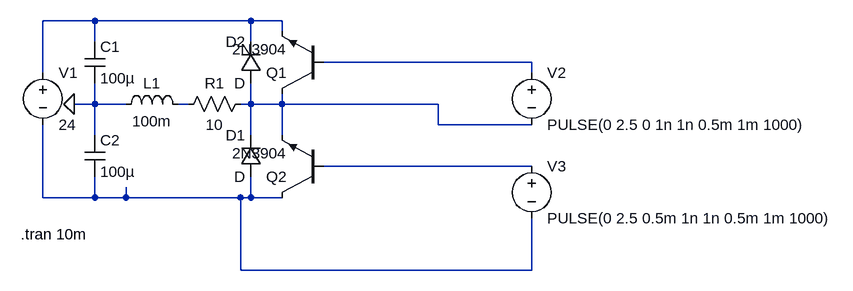
[diagram p0: schematic Halfbridge.asc]
Halfbridge.asc, the LTspice schematic file:
Version 4
SHEET 1 1244 680
WIRE 80 0 0 0
WIRE 320 0 80 0
WIRE 368 0 320 0
WIRE 368 16 368 0
WIRE 80 32 80 0
WIRE 320 32 320 0
WIRE 752 64 432 64
WIRE 0 80 0 0
WIRE 752 80 752 64
WIRE 80 128 80 96
WIRE 80 128 48 128
WIRE 128 128 80 128
WIRE 224 128 208 128
WIRE 320 128 320 96
WIRE 320 128 304 128
WIRE 368 128 368 112
WIRE 368 128 320 128
WIRE 608 128 368 128
WIRE 608 160 608 128
WIRE 752 160 608 160
WIRE 80 176 80 128
WIRE 320 176 320 128
WIRE 368 176 368 128
WIRE 752 224 432 224
WIRE 0 272 0 160
WIRE 80 272 80 240
WIRE 80 272 0 272
WIRE 128 272 128 256
WIRE 128 272 80 272
WIRE 304 272 128 272
WIRE 320 272 320 240
WIRE 320 272 304 272
WIRE 368 272 320 272
WIRE 304 384 304 272
WIRE 752 384 752 304
WIRE 752 384 304 384
FLAG 48 128 0
SYMBOL voltage 752 64 R0
WINDOW 123 0 0 Left 0
WINDOW 39 0 0 Left 0
SYMATTR InstName V2
SYMATTR Value PULSE(0 2.5 0 1n 1n 0.5m 1m 1000)
SYMBOL voltage 752 208 R0
WINDOW 123 0 0 Left 0
WINDOW 39 0 0 Left 0
SYMATTR InstName V3
SYMATTR Value PULSE(0 2.5 0.5m 1n 1n 0.5m 1m 1000)
SYMBOL res 320 112 R90
WINDOW 0 0 56 VBottom 2
WINDOW 3 32 56 VTop 2
SYMATTR InstName R1
SYMATTR Value 10
SYMBOL diode 336 240 R180
WINDOW 0 24 64 Left 2
WINDOW 3 24 0 Left 2
SYMATTR InstName D1
SYMBOL diode 336 96 R180
WINDOW 0 24 64 Left 2
WINDOW 3 24 0 Left 2
SYMATTR InstName D2
SYMBOL npn 432 112 R180
SYMATTR InstName Q1
SYMATTR Value 2N3904
SYMBOL npn 432 272 R180
SYMATTR InstName Q2
SYMATTR Value 2N3904
SYMBOL ind 112 144 R270
WINDOW 0 32 56 VTop 2
WINDOW 3 5 56 VBottom 2
SYMATTR InstName L1
SYMATTR Value 100m
SYMBOL cap 64 32 R0
SYMATTR InstName C1
SYMATTR Value 100µ
SYMBOL cap 64 176 R0
SYMATTR InstName C2
SYMATTR Value 100µ
SYMBOL voltage 0 64 R0
WINDOW 123 0 0 Left 0
WINDOW 39 0 0 Left 0
SYMATTR InstName V1
SYMATTR Value 24
TEXT -34 328 Left 2 !.tran 10m

The netlist it stands for:
* Halfbridge.asc
V2 N002 N004 PULSE(0 2.5 0 1n 1n 0.5m 1m 1000)
V3 N005 N006 PULSE(0 2.5 0.5m 1n 1n 0.5m 1m 1000)
R1 N004 N003 10
D1 N006 N004 D
D2 N004 N001 D
Q1 N004 N002 N001 0 2N3904
Q2 N006 N005 N004 0 2N3904
L1 0 N003 100m
C1 N001 0 100µ
C2 0 N006 100µ
V1 N001 N006 24
.model D D
.lib standard.dio
.model NPN NPN
.model PNP PNP
.lib standard.bjt
.tran 10m
.backanno
.end